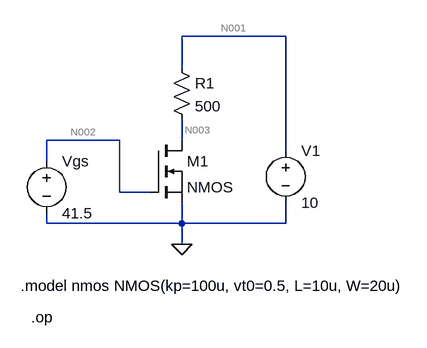
[diagram p0: schematic TASK3_2v.asc]
TASK3_2v.asc, the LTspice schematic file:
Version 4
SHEET 1 880 680
WIRE 384 32 224 32
WIRE 224 80 224 32
WIRE 128 192 16 192
WIRE 224 192 224 160
WIRE 384 208 384 32
WIRE 16 224 16 192
WIRE 128 272 128 192
WIRE 176 272 128 272
WIRE 16 320 16 304
WIRE 224 320 224 288
WIRE 224 320 16 320
WIRE 384 320 384 288
WIRE 384 320 224 320
WIRE 224 352 224 320
FLAG 224 352 0
SYMBOL nmos 176 192 R0
SYMATTR InstName M1
SYMBOL voltage 16 208 R0
SYMATTR InstName Vgs
SYMATTR Value 41.5
SYMBOL voltage 384 192 R0
SYMATTR InstName V1
SYMATTR Value 10
SYMBOL res 208 64 R0
SYMATTR InstName R1
SYMATTR Value 500
TEXT -24 416 Left 2 !.model nmos NMOS(kp=100u, vt0=0.5, L=10u, W=20u)
TEXT -8 464 Left 2 !.op

The netlist it stands for:
* TASK3_2v.asc
M1 N003 N002 0 0 NMOS
Vgs N002 0 41.5
V1 N001 0 10
R1 N001 N003 500
.model NMOS NMOS
.model PMOS PMOS
.lib standard.mos
.model nmos NMOS(kp=100u, vt0=0.5, L=10u, W=20u)
.op
.backanno
.end

* Results of the author's LTspice run, read from the files saved beside the schematic
* Operating Point:
*   V(n003) = 2 V
*   V(n002) = 41.5 V
*   V(n001) = 10 V
*   Id(M1) = 16 mA
*   Ig(M1) = 0 A
*   Ib(M1) = -2.01 pA
*   Is(M1) = -16 mA
*   I(R1) = 16 mA
*   I(V1) = -16 mA
*   I(Vgs) = 0 A
* From the log:
*   Semiconductor Device Operating Points:
*                           --- MOSFET Transistors ---
*   Name:          m1
*   Model:        nmos
*   Id:          1.60e-02
*   Vgs:         4.15e+01
*   Vds:         2.00e+00
*   Vbs:         0.00e+00
*   Vth:         5.00e-01
*   Vdsat:       4.10e+01
*   Gm:          4.00e-04
*   Gds:         7.80e-03
*   Gmb:         0.00e+00
*   Cbd:         0.00e+00
*   Cbs:         0.00e+00
*   Cgsov:       0.00e+00
*   Cgdov:       0.00e+00
*   Cgbov:       0.00e+00
*   Cgs:         0.00e+00
*   Cgd:         0.00e+00
*   Cgb:         0.00e+00